# EAGLE schematic SingleTransistor (EAGLE 9.6.2)
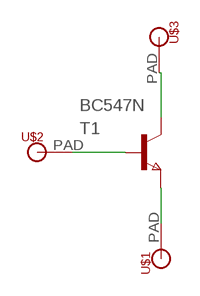
[diagram p0: schematic, sheet 1]

## Parts
T1  BC547N  [TO92]
U$1  MICROBIT_PAD  [MICROBIT_PAD]
U$2  MICROBIT_PAD  [MICROBIT_PAD]
U$3  MICROBIT_PAD  [MICROBIT_PAD]

## Nets
N$1: T1.1(C) U$3.PAD
N$3: T1.3(E) U$1.PAD
T1: T1.2(B) U$2.PAD

## Library data of the parts
T1 = BC547:BC547: Check availability <https://pricing.snapeda.com/parts/BC547/ON%20Semiconductor/view-part?ref=eda>; AVAILABILITY: In Stock; CHECK_PRICES: https://www.snapeda.com/parts/BC547/Onsemi/view-part/?ref=eda; DESCRIPTION: Trans GP BJT NPN 45V 0.1A 500mW 3-Pin TO-92 T/R; MF: ON Semiconductor; MP: BC547; PACKAGE: None; PRICE: None; PURCHASE-URL: https://www.snapeda.com/api/url_track_click_mouser/?unipart_id=11254981&manufacturer=ON Semiconductor&part_name=BC547&search_term=None; SNAPEDA_LINK: https://www.snapeda.com/parts/BC547/Onsemi/view-part/?ref=snap
U$1-U$3 = microbit:MICROBIT_PAD